# Altium schematic sheet Van Atta array.SchDoc
size A; DocumentNumber: 5; SheetNumber: 5; SheetTotal: 6
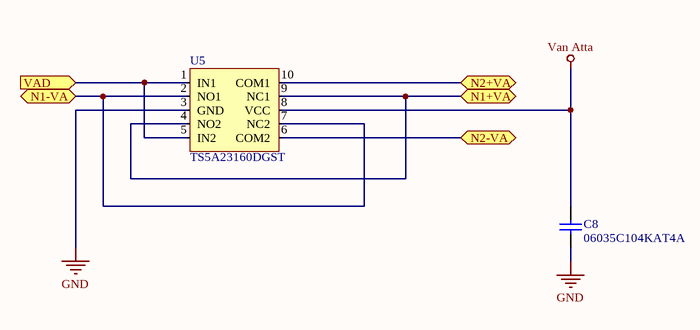
[diagram p0: Van Atta array.SchDoc]

## Parts
C8  06035C104KAT4A  [CAPC1608X90X35LL15T15]
U5  TS5A23160DGST  [TSSOP50P490X110-10N]

## Ports
N1+VA (bidir), N1-VA (bidir), N2+VA (bidir), N2-VA (bidir), VAD (in)

## Nets
GND: C8.2 U5.3(GND)
Van Atta: C8.1 U5.8(VCC)
N1+VA: U5.4(NO2) U5.9(NC1) ; port N1+VA
N1-VA: U5.2(NO1) U5.7(NC2) ; port N1-VA
N2+VA: U5.10(COM1) ; port N2+VA
N2-VA: U5.6(COM2) ; port N2-VA
VAD: U5.1(IN1) U5.5(IN2) ; port VAD

## Library data of the parts
C8 = CMP-2006-04390-1: Manufacturer: AVX Interconnect / Elco; Part Number: 06035C104KAT4A
U5 = CMP-011-00013-3: 0.9-Ω on-state resistance, 5-V, 2: 1 (SPDT), 2-channel analog switch 10-VSSOP -40 to 85